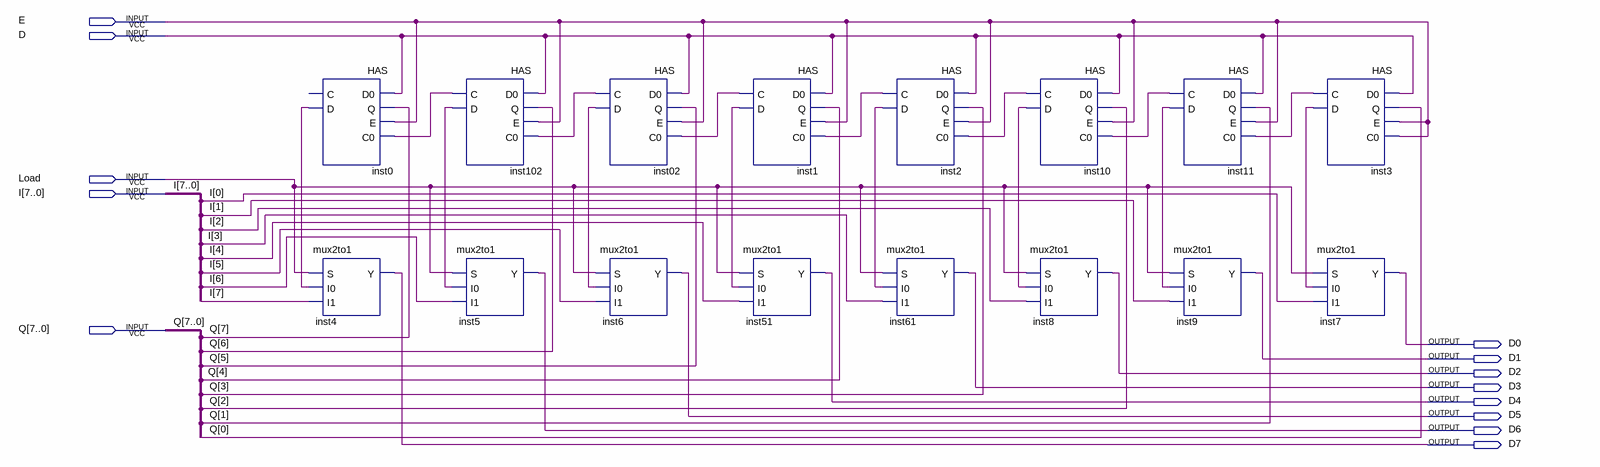
[diagram p0: schematic sheet]
// Quartus schematic Circuit.bdf as structural Verilog: 16 symbols, 13 pins
module Circuit (
  input  E,
  input  D,
  input  Load,
  input  [7:0] I,
  input  [7:0] Q,
  output D0,
  output D1,
  output D2,
  output D3,
  output D4,
  output D5,
  output D6,
  output D7
);

  wire inst0_d, inst1_c, inst1_d, inst02_c, inst2_c, inst02_d, inst2_d, inst3_c, inst3_d, inst10_c, inst10_d,
       inst11_c, inst11_d, inst102_c, inst102_d;

  HAS inst0 (.D0(D), .Q(Q[7]), .E(E), .C0(inst102_c), .D(inst0_d));  // open: C
  mux2to1 inst4 (.S(Load), .I0(inst0_d), .I1(I[7]), .Y(D7));
  HAS inst102 (.D0(D), .Q(Q[6]), .E(E), .C0(inst02_c), .C(inst102_c), .D(inst102_d));
  mux2to1 inst5 (.S(Load), .I0(inst102_d), .I1(I[6]), .Y(D6));
  HAS inst02 (.D0(D), .Q(Q[5]), .E(E), .C0(inst1_c), .C(inst02_c), .D(inst02_d));
  mux2to1 inst6 (.S(Load), .I0(inst02_d), .I1(I[5]), .Y(D5));
  HAS inst1 (.D0(D), .Q(Q[4]), .E(E), .C0(inst2_c), .C(inst1_c), .D(inst1_d));
  mux2to1 inst51 (.S(Load), .I0(inst1_d), .I1(I[4]), .Y(D4));
  HAS inst2 (.D0(D), .Q(Q[3]), .E(E), .C0(inst10_c), .C(inst2_c), .D(inst2_d));
  mux2to1 inst61 (.S(Load), .I0(inst2_d), .I1(I[3]), .Y(D3));
  HAS inst10 (.D0(D), .Q(Q[2]), .E(E), .C0(inst11_c), .C(inst10_c), .D(inst10_d));
  mux2to1 inst8 (.S(Load), .I0(inst10_d), .I1(I[2]), .Y(D2));
  HAS inst11 (.D0(D), .Q(Q[1]), .E(E), .C0(inst3_c), .C(inst11_c), .D(inst11_d));
  mux2to1 inst9 (.S(Load), .I0(inst11_d), .I1(I[1]), .Y(D1));
  HAS inst3 (.D0(D), .Q(Q[0]), .E(E), .C0(E), .C(inst3_c), .D(inst3_d));
  mux2to1 inst7 (.S(Load), .I0(inst3_d), .I1(I[0]), .Y(D0));
endmodule
